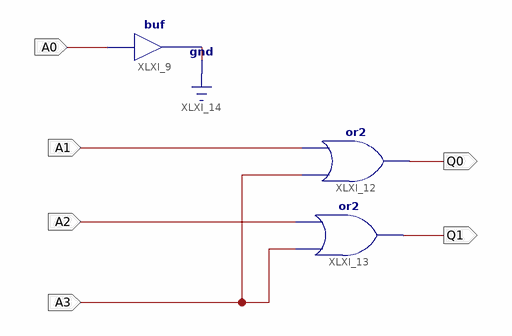
[diagram p0: schematic sheet 1]
// Xilinx ISE schematic encoder.sch (spartan6) as structural Verilog: 3 symbols, 6 ports
module encoder (
  input  A0,
  input  A3,
  input  A2,
  input  A1,
  output Q0,
  output Q1
);

  // buf XLXI_9 has open pins: I=A0, O=1'b0
  or XLXI_12 (Q0, A3, A1);
  or XLXI_13 (Q1, A3, A2);
endmodule
